# Altium schematic sheet USF-IEEE-CS.SchDoc
size A3; SheetNumber: 1; SheetTotal: 1
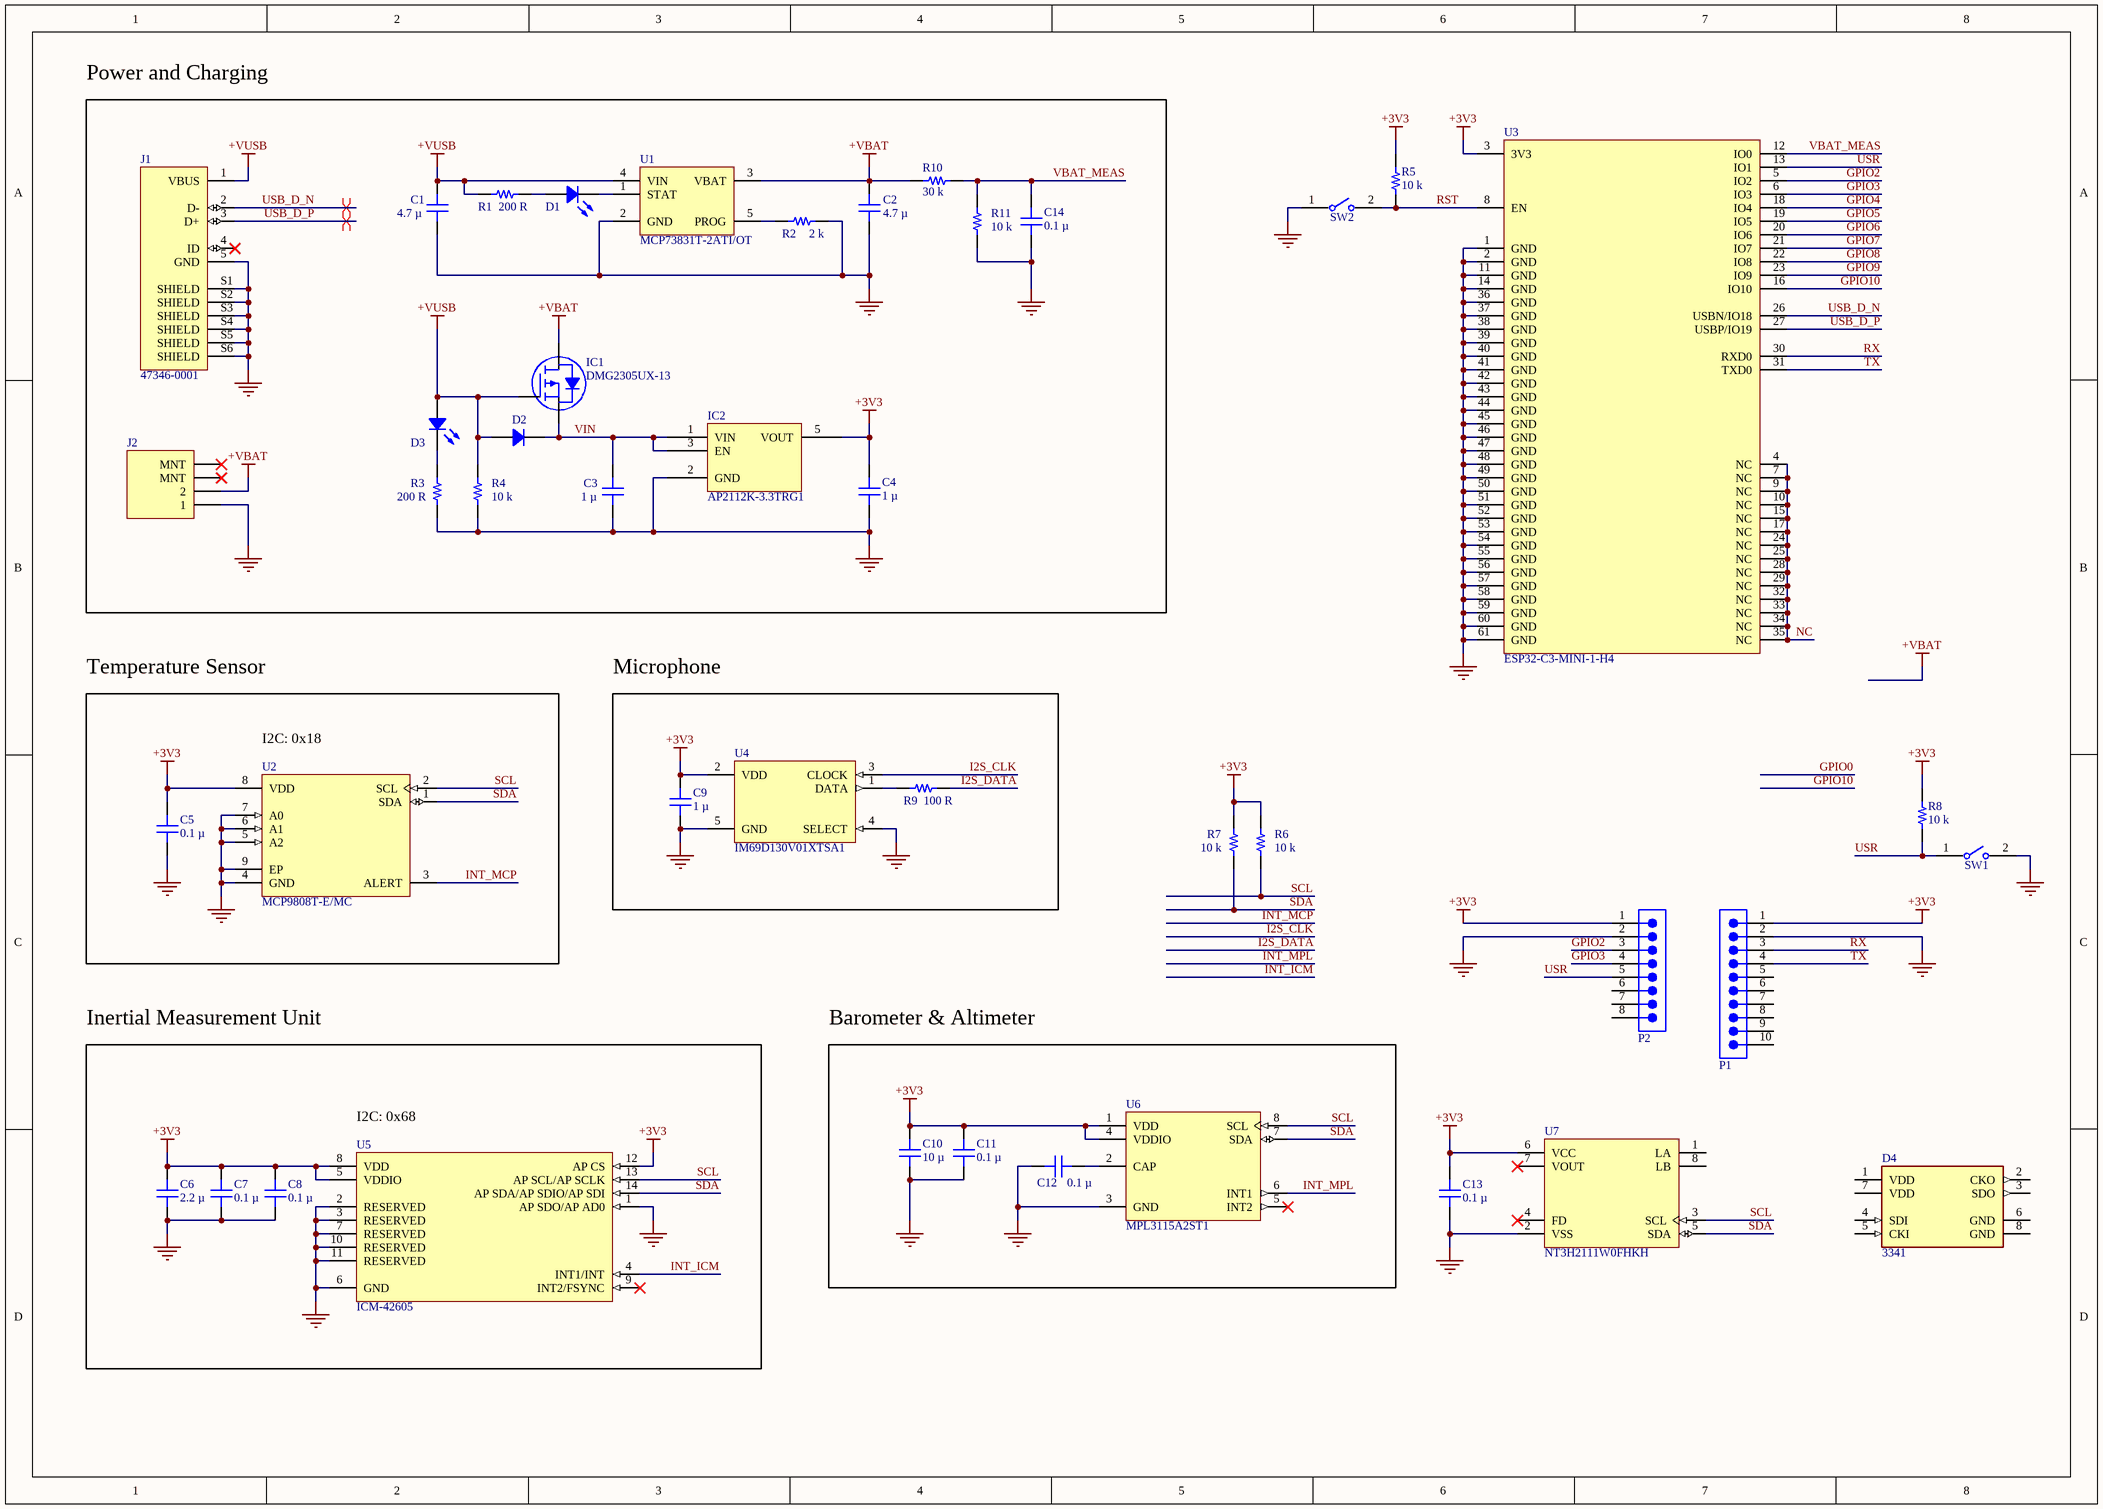
[diagram p0: USF-IEEE-CS.SchDoc]

## Parts
C1  Capacitance: 4.7 µ  [CAP 0402_1005]  (hidden comment: 4.7 µF)
C2  Capacitance: 4.7 µ  [CAP 0402_1005]  (hidden comment: 4.7 µF)
C3  1 µ  [CAP 0402_1005]
C4  1 µ  [CAP 0402_1005]
C5  Capacitance: 0.1 µ  [CAP 0402_1005]  (hidden comment: 0.1 µF)
C6  Capacitance: 2.2 µ  [CAP 0402_1005]  (hidden comment: 2.2 µF)
C7  Capacitance: 0.1 µ  [CAP 0402_1005]  (hidden comment: 0.1 µF)
C8  Capacitance: 0.1 µ  [CAP 0402_1005]  (hidden comment: 0.1 µF)
C9  1 µ  [CAP 0402_1005]
C10  Capacitance: 10 µ  [CAP 0603_1608]  (hidden comment: 10 µF)
C11  Capacitance: 0.1 µ  [CAP 0402_1005]  (hidden comment: 0.1 µF)
C12  Capacitance: 0.1 µ  [CAP 0402_1005]  (hidden comment: 0.1 µF)
C13  Capacitance: 0.1 µ  [CAP 0402_1005]  (hidden comment: 0.1 µF)
C14  Capacitance: 0.1 µ  [CAP 0402_1005]  (hidden comment: 0.1 µF)
D1  Red  [LED 0603_1608 RED]  (value not drawn)
D2  MBR120ESFT1G  [SOD123F]  (value not drawn)
D3  Blue  [LED 0603_1608 BLUE]  (value not drawn)
D4  3341  [FP-3341-MFG]
IC1  DMG2305UX-13  [DIODES SOT-23-3]
IC2  AP2112K-3.3TRG1  [DIODES SOT-23-5 W5]
J1  47346-0001  [MOLEX_47346-0001]
J2  SM02B-GHS-TB(LF)(SN)  [FP-SM02B-GHS-TB_LF_SN-MFG]  (value not drawn)
P1  61301011121  [61301011121]  (value not drawn)
P2  61300811121  [61300811121]  (value not drawn)
R1  200 R  [RES 0402_1005]
R2  2 k  [RES 0402_1005]
R3  200 R  [RES 0402_1005]
R4  10 k  [RES 0402_1005]
R5  10 k  [RES 0402_1005]
R6  10 k  [RES 0402_1005]
R7  10 k  [RES 0402_1005]
R8  10 k  [RES 0402_1005]
R9  100 R  [RES 0402_1005]
R10  30 k  [RES 0402_1005]
R11  10 k  [RES 0402_1005]
SW1  B3U-1000P  [FP-B3U-1000P-MFG]  (value not drawn)
SW2  B3U-1000P  [FP-B3U-1000P-MFG]  (value not drawn)
U1  MCP73831T-2ATI/OT  [FP-C04-091-OT-MFG]
U2  MCP9808T-E/MC  [MCHP-DFN-MC8_V]
U3  ESP32-C3-MINI-1-H4  [ESP32C3MINI1H4]
U4  IM69D130V01XTSA1  [FP-PG-LLGA-5-MFG]
U5  ICM-42605  [FP-ICM-42605-MFG]
U6  MPL3115A2ST1  [FRES-2153-01_V]
U7  NT3H2111W0FHKH  [NT3H2111W0FHKH-FP]

## Blocks framed on the sheet
Power and Charging: C1-C4 C14 D1-D3 IC1 IC2 J1 J2 R1-R4 R10 R11 U1
Temperature Sensor: C5 U2
Microphone: C9 R9 U4
Inertial Measurement Unit: C6-C8 U5
Barometer & Altimeter: C10-C12 U6

## Nets
+3V3: C4.2 C5.2 C6.2 C7.2 C8.2 C9.2 C10.2 C11.2 C13.2 IC2.5(VOUT) P1.1 P2.1 R5.2 R6.2 R7.2 R8.2 U2.8(VDD) U3.3(3V3) U4.2(VDD) U5.5(VDDIO) U5.8(VDD) U5.12(AP_CS) U6.1(VDD) U6.4(VDDIO) U7.6(VCC)
+VBAT: C2.2 IC1.3(D) J2.2 R10.2 U1.3(VBAT)
+VUSB: C1.2 D2.1 D3.1 IC1.1(G) J1.1(VBUS) R1.2 R4.1 U1.4(VIN)
GND: C1.1 C2.1 C3.1 C4.1 C5.1 C6.1 C7.1 C8.1 C9.1 C10.1 C11.1 C12.2 C13.1 C14.1 IC2.2(GND) J1.5(GND) J1.S1(SHIELD) J1.S2(SHIELD) J1.S3(SHIELD) J1.S4(SHIELD) J1.S5(SHIELD) J1.S6(SHIELD) J2.1 P1.2 P2.2 R2.2 R3.1 R4.2 R11.1 SW1.2 SW2.1 U1.2(GND) U2.4(GND) U2.5(A2) U2.6(A1) U2.7(A0) U2.9(EP) U3.1(GND) U3.2(GND) U3.11(GND) U3.14(GND) U3.36(GND) U3.37(GND) U3.38(GND) U3.39(GND) U3.40(GND) U3.41(GND) U3.42(GND) U3.43(GND) U3.44(GND) U3.45(GND) U3.46(GND) U3.47(GND) U3.48(GND) U3.49(GND) U3.50(GND) U3.51(GND) U3.52(GND) U3.53(GND) U3.54(GND) U3.55(GND) U3.56(GND) U3.57(GND) U3.58(GND) U3.59(GND) U3.60(GND) U3.61(GND) U4.4(SELECT) U4.5(GND) U5.1(AP_SDO/AP_AD0) U5.2(RESERVED) U5.3(RESERVED) U5.6(GND) U5.7(RESERVED) U5.10(RESERVED) U5.11(RESERVED) U6.3(GND) U7.2(VSS)
GPIO2: P2.3 U3.5(IO2)
GPIO3: P2.4 U3.6(IO3)
GPIO4: U3.18(IO4)
GPIO5: U3.19(IO5)
GPIO6: U3.20(IO6)
GPIO7: U3.21(IO7)
GPIO8: U3.22(IO8)
GPIO9: U3.23(IO9)
GPIO10: U3.16(IO10)
I2S_CLK: U4.3(CLOCK)
I2S_DATA: R9.2
INT_ICM: U5.4(INT1/INT)
INT_MCP: U2.3(ALERT)
INT_MPL: U6.6(INT1)
NC: U3.4(NC) U3.7(NC) U3.9(NC) U3.10(NC) U3.15(NC) U3.17(NC) U3.24(NC) U3.25(NC) U3.28(NC) U3.29(NC) U3.32(NC) U3.33(NC) U3.34(NC) U3.35(NC)
RST: R5.1 SW2.2 U3.8(EN)
RX: P1.3 U3.30(RXD0)
SCL: R6.1 U2.2(SCL) U5.13(AP_SCL/AP_SCLK) U6.8(SCL) U7.3(SCL)
SDA: R7.1 U2.1(SDA) U5.14(AP_SDA/AP_SDIO/AP_SDI) U6.7(SDA) U7.5(SDA)
TX: P1.4 U3.31(TXD0)
USB_D_N: J1.2(D-) U3.26(USBN/IO18)
USB_D_P: J1.3(D+) U3.27(USBP/IO19)
USR: P2.5 R8.1 SW1.1 U3.13(IO1)
VBAT_MEAS: C14.2 R10.1 R11.2 U3.12(IO0)
VIN: C3.2 D2.2 IC1.2(S) IC2.1(VIN) IC2.3(EN)
NetC12_1: C12.1 U6.2(CAP)
NetD1_1: D1.1 R1.1
NetD1_2: D1.2 U1.1(STAT)
NetD3_2: D3.2 R3.2
NetR2_1: R2.1 U1.5(PROG)
NetR9_1: R9.1 U4.1(DATA)

Not connected (* = marked no-connect by the designer): D4 1(VDD) 2(CKO) 3(SDO) 4(SDI) 5(CKI) 6(GND) 7(VDD) 8(GND); J1 4(ID)*; J2 3(MNT)* 4(MNT)*; P1 5 6 7 8 9 10; P2 6 7 8; U5 9(INT2/FSYNC)*; U6 5(INT2)*; U7 1(LA) 4(FD)* 7(VOUT)* 8(LB)

## Layout directives
differential pair: USB_D_N, USB_D_P

## Notes on the sheet
- (near U2) I2C: 0x18
- (near U5) I2C: 0x68
- DWG. NO.
- REV.
- SHT.
- THIS DOCUMENT AND THE DATA DISCLOSED HEREIN OR HEREWITH IS THE PROPERTY OF ALTIUM LIMITED AND MAY BE FREELY DISTRIBUTED IN WHOLE. NO RIGHTS ARE RESERVED OR EXPRESS OR IMPLIED WARANTEE GIVEN.
- REVISION
- DESCRIPTION
- DATE
- APPROVED
- ENG:
- APPROVALS
- PROJECT
- DSN:
- CHK:
- REFERENCE DOCUMENTS
- PROJECT REVISION:
- TITLE
- DOCUMENT REVISION:
- DESIGN ITEM:
- BOM:
- FAB DWG:
- PCB DWG:
- ASSY DWG:
- SCALE:
- SIZE
- B
- CAGE CODE
- FILE NAME
- DWG NO.
- SHEET
- OF
- REV

## Library data of the parts
C1 C2 = CL05A475KP5NRNC: CAP CER 4.7UF 10V X5R 0402; manufacturer: Samsung Electro-Mechanics; Tolerance: ±10%; Part Number: CL05A475KP5NRNC; Applications: General Purpose; componentlink1description: Datasheet; componentlink1url: http://www.samsungsem.com/kr/support/product-search/mlcc/CL05A475KP5NRNC.jsp; componentlink2description: DigiKey Link; componentlink2url: https://www.digikey.com/en/products/detail/samsung-electro-mechanics/CL05A475KP5NRNC/3887138; Device Package: 0402 (1005 Metric); lastupdated: 2/9/2024 8:04:37 PM; Lifecycle Status: Active; Minimum Order: 1; Mounting Type: Surface Mount, MLCC; Operating Temperature: -55°C ~ 85°C; Package / Case: 0402 (1005 Metric); packaging: TapeAndReel; partid: 2191; Part Status: Active; price: 0.04; series: CL; Size / Dimension: 0.039" L x 0.020" W (1.00mm x 0.50mm); Supplier 1: DigiKey; Supplier Part Number 1: 1276-1480-1-ND; Temperature Coefficient: X5R; Thickness (Max): 0.026" (0.65mm); value: 4.7 µF; Voltage - Rated: 10V
C3 C4 C9 = 885012105012: CAP CER 1UF 10V X5R 0402; manufacturer: Würth Elektronik; Capacitance: 1 µF; Tolerance: ±20%; Part Number: 885012105012; Value: 1 µ; Applications: General Purpose; componentlink1description: Datasheet; componentlink1url: https://katalog.we-online.de/pbs/datasheet/885012105012.pdf; componentlink2description: DigiKey Link; componentlink2url: https://www.digikey.com/en/products/detail/würth-elektronik/885012105012/5453344; Device Package: 0402 (1005 Metric); lastupdated: 2/9/2024 8:04:38 PM; Lifecycle Status: Active; Minimum Order: 1; Mounting Type: Surface Mount, MLCC; Operating Temperature: -55°C ~ 85°C; Package / Case: 0402 (1005 Metric); packaging: TapeAndReel; partid: 1807; Part Status: Active; price: 0.16; series: WCAP-CSGP; Size / Dimension: 0.039" L x 0.020" W (1.00mm x 0.50mm); Supplier 1: DigiKey; Supplier Part Number 1: 732-7489-1-ND; Temperature Coefficient: X5R; Thickness (Max): 0.022" (0.55mm); Voltage - Rated: 10V
C5 C7 C8 C11-C14 = CGA2B3X5R1H104M050BB: CAP CER 0.1UF 50V X5R 0402; manufacturer: TDK Corporation; Tolerance: ±20%; Part Number: CGA2B3X5R1H104M050BB; Applications: Automotive; componentlink1description: Datasheet; componentlink1url: https://product.tdk.com/info/en/catalog/datasheets/mlcc_automotive_general_en.pdf?ref_disty=digikey; componentlink2description: DigiKey Link; componentlink2url: https://www.digikey.com/en/products/detail/tdk-corporation/CGA2B3X5R1H104M050BB/3949450; Device Package: 0402 (1005 Metric); lastupdated: 2/9/2024 8:04:38 PM; Lifecycle Status: Active; Minimum Order: 1; Mounting Type: Surface Mount, MLCC; Operating Temperature: -55°C ~ 85°C; Package / Case: 0402 (1005 Metric); packaging: TapeAndReel; partid: 1792; Part Status: Active; price: 0.01; Ratings: AEC-Q200; series: CGA; Size / Dimension: 0.039" L x 0.020" W (1.00mm x 0.50mm); Supplier 1: DigiKey; Supplier Part Number 1: 445-12214-1-ND; Temperature Coefficient: X5R; Thickness (Max): 0.022" (0.55mm); value: 0.1 µF; Voltage - Rated: 50V
C6 = TMK105CBJ225KV-F: CAP CER 2.2UF 25V X5R 0402; manufacturer: Taiyo Yuden; Tolerance: ±10%; Part Number: TMK105CBJ225KV-F; Applications: SMPS Filtering; componentlink1description: Datasheet; componentlink1url: https://ds.yuden.co.jp/TYCOMPAS/ut/detail?pn=TMK105CBJ225KV-F &u=M; componentlink2description: DigiKey Link; componentlink2url: https://www.digikey.com/en/products/detail/taiyo-yuden/TMK105CBJ225KV-F/7403799; Device Package: 0402 (1005 Metric); lastupdated: 2/9/2024 8:04:38 PM; Lifecycle Status: Active; Minimum Order: 1; Mounting Type: Surface Mount, MLCC; Operating Temperature: -55°C ~ 85°C; Package / Case: 0402 (1005 Metric); packaging: TapeAndReel; partid: 1822; Part Status: Active; price: 0.02; series: M; Size / Dimension: 0.039" L x 0.020" W (1.00mm x 0.50mm); Supplier 1: DigiKey; Supplier Part Number 1: 587-6277-1-ND; Temperature Coefficient: X5R; Thickness (Max): 0.028" (0.70mm); value: 2.2 µF; Voltage - Rated: 25V
C10 = GRT188R61C106ME13D: CAP CER 10UF 16V X5R 0603; manufacturer: Murata Electronics; Tolerance: ±20%; Part Number: GRT188R61C106ME13D; Applications: Automotive; componentlink1description: Datasheet; componentlink1url: https://search.murata.co.jp/Ceramy/image/img/A01X/G101/ENG/GRT188R61C106ME13-01.pdf; componentlink2description: DigiKey Link; componentlink2url: https://www.digikey.com/en/products/detail/murata-electronics/GRT188R61C106ME13D/5416740; Device Package: 0603 (1608 Metric); lastupdated: 2/9/2024 8:10:30 PM; Lifecycle Status: Active; Minimum Order: 1; Mounting Type: Surface Mount, MLCC; Operating Temperature: -55°C ~ 85°C; Package / Case: 0603 (1608 Metric); packaging: TapeAndReel; partid: 2515; Part Status: Active; price: 0.06; Ratings: AEC-Q200; series: GRT; Size / Dimension: 0.063" L x 0.031" W (1.60mm x 0.80mm); Supplier 1: DigiKey; Supplier Part Number 1: 490-12318-1-ND; Temperature Coefficient: X5R; Thickness (Max): 0.035" (0.90mm); value: 10 µF; Voltage - Rated: 16V
D1 = XZMDK53W-8ST: LED RED CLEAR CHIP SMD; Manufacturer: SunLED; Configuration: Standard; Current - Test: 20mA; Lens Color: Colorless; Lens Size: 0.70mm Dia; Lens Style: Round with Domed Top; Millicandela Rating: 507mcd; Viewing Angle: 100°; Voltage - Forward (Vf) (Typ): 1.95V; Wavelength - Dominant: 630nm; Wavelength - Peak: 645nm; Part Number: XZMDK53W-8ST; Color: Red; ComponentLink1Description: Datasheet; ComponentLink1URL: https://www.sunledusa.com/products/spec/XZMDK53W-8ST.pdf; ComponentLink2Description: DigiKey Link; ComponentLink2URL: https://www.digikey.com/en/products/detail/sunled/XZMDK53W-8ST/8259034; Device Package: 0603 (1608 Metric); Height (Max): 0.80mm; LastUpdated: 6/3/2024 7:59:48 PM; Lens Transparency: Clear; Lifecycle Status: Active; Minimum Order: 1; Mounting Type: Surface Mount; Package / Case: 0603 (1608 Metric); Packaging: TapeAndReel; PartId: 377; Part Status: Active; Price: 0.07; Series: -; Size / Dimension: 1.60mm L x 0.80mm W; Supplier 1: DigiKey; Supplier Part Number 1: 1497-1427-1-ND; Supplier Device Package: Chip LED; Value: Red
D2 = MBR120ESFT1G: DIODE SCHOTTKY 20V 1A SOD123L; Manufacturer: ON Semiconductor; Current - Reverse Leakage @ Vr: 10µA @ 20V; Speed: Fast Recovery =< 500ns, > 200mA (Io); Voltage - Forward (Vf) (Max) @ If: 530mV @ 1A; Part Number: MBR120ESFT1G; ComponentLink1Description: Datasheet; ComponentLink1URL: http://www.onsemi.com/pub/Collateral/MBR120ESFT1-D.PDF; ComponentLink2Description: DigiKey Link; ComponentLink2URL: http://digikey.com/product-detail/en/on-semiconductor/MBR120ESFT1G/MBR120ESFT1GOSCT-ND/964525; Current - Average Rectified (Io): 1A; Diode Type: Schottky; LastUpdated: 6/3/2024 7:54:58 PM; Lifecycle Status: Active; Minimum Order: 1; Mounting Type: Surface Mount; Operating Temperature - Junction: -65°C ~ 150°C; Package / Case: SOD-123F; Packaging: TapeAndReel; PartId: 2351; Part Status: Active; Price: 0.09; Series: -; Supplier 1: DigiKey; Supplier Part Number 1: MBR120ESFT1GOSCT-ND; Supplier Device Package: SOD-123L; Voltage - DC Reverse (Vr) (Max): 20V
D3 = LTST-C193TBKT-5A: LED BLUE CLEAR CHIP SMD; Manufacturer: Lite-On Inc.; Configuration: Standard; Current - Test: 5mA; Lens Color: Colorless; Lens Size: 1.15mm x 0.80mm; Lens Style: Rectangle with Flat Top; Millicandela Rating: 15mcd; Viewing Angle: 130°; Voltage - Forward (Vf) (Typ): 2.8V; Wavelength - Dominant: 470nm; Wavelength - Peak: 468nm; Part Number: LTST-C193TBKT-5A; Color: Blue; ComponentLink1Description: Datasheet; ComponentLink1URL: //media.digikey.com/pdf/Data%20Sheets/Lite-On%20PDFs/LTST-C193TBKT-5A.pdf; ComponentLink2Description: DigiKey Link; ComponentLink2URL: http://digikey.com/product-detail/en/lite-on-inc/LTST-C193TBKT-5A/160-1827-1-ND/2355044; Device Package: 0603 (1608 Metric); Height (Max): 0.45mm; LastUpdated: 6/3/2024 7:57:52 PM; Lens Transparency: Clear; Lifecycle Status: Active; Minimum Order: 1; Mounting Type: Surface Mount; Package / Case: 0603 (1608 Metric); Packaging: TapeAndReel; PartId: 829; Part Status: Active; Price: 0.06; Series: -; Size / Dimension: 1.60mm L x 0.80mm W; Supplier 1: DigiKey; Supplier Part Number 1: 160-1827-1-ND; Supplier Device Package: Chip LED; Value: Blue
D4 = CMP-007-00045-1: DotStar Micro LEDs (APA102-2020) - Smart SMD RGB LED - 10 Pack
IC1 = DMG2305UX-13: MOSFET P-CH 20V 4.2A SOT23; Manufacturer: Diodes Incorporated; Current - Continuous Drain (Id) @ 25°C: 4.2A (Ta); Drive Voltage (Max Rds On,  Min Rds On): 1.8V, 4.5V; FET Type: P-Channel; Gate Charge (Qg) (Max) @ Vgs: 10.2 nC @ 4.5 V; Input Capacitance (Ciss) (Max) @ Vds: 808 pF @ 15 V; Power Dissipation (Max): 1.4W (Ta); Rds On (Max) @ Id, Vgs: 52mOhm @ 4.2A, 4.5V; Vgs (Max): ±8V; Vgs(th) (Max) @ Id: 900mV @ 250µA; Part Number: DMG2305UX-13; ComponentLink1Description: Datasheet; ComponentLink1URL: https://www.diodes.com/assets/Datasheets/DMG2305UX.pdf; ComponentLink2Description: DigiKey Link; ComponentLink2URL: https://www.digikey.com/en/products/detail/diodes-incorporated/DMG2305UX-13/4251560; Drain to Source Voltage (Vdss): 20 V; LastUpdated: 6/3/2024 8:15:20 PM; Lifecycle Status: Active; Minimum Order: 1; Mounting Type: Surface Mount; Operating Temperature: -55°C ~ 150°C (TJ); Package / Case: TO-236-3, SC-59, SOT-23-3; Packaging: TapeAndReel; Part Status: Active; Price: 0.04; Series: -; Supplier 1: DigiKey; Supplier Part Number 1: DMG2305UX-13DICT-ND; Supplier Device Package: SOT-23-3; Technology: MOSFET (Metal Oxide)
IC2 = AP2112K-3.3TRG1: IC REG LINEAR 3.3V 600MA SOT25; Manufacturer: Diodes Incorporated; Control Features: Enable; Current - Quiescent (Iq): 80 µA; Number of Regulators: 1; Output Configuration: Positive; Output Type: Fixed; Protection Features: Over Current, Over Temperature; PSRR: 65sB (100Hz ~ 1KHz); Voltage Dropout (Max): 0.4V @ 600mA; Voltage - Input (Max): 6V; Part Number: AP2112K-3.3TRG1; ComponentLink1Description: Datasheet; ComponentLink1URL: https://www.diodes.com/assets/Datasheets/AP2112.pdf; ComponentLink2Description: DigiKey Link; ComponentLink2URL: https://www.digikey.com/en/products/detail/diodes-incorporated/AP2112K-3-3TRG1/4470746; Current - Output: 600mA; LastUpdated: 6/3/2024 8:17:11 PM; Lifecycle Status: Active; Minimum Order: 1; Mounting Type: Surface Mount; Operating Temperature: -40°C ~ 85°C; Package / Case: SC-74A, SOT-753; Packaging: TapeAndReel; Part Status: Active; Price: 0.08; Series: -; Supplier 1: DigiKey; Supplier Part Number 1: AP2112K-3.3TRG1DICT-ND; Supplier Device Package: SOT-25; Voltage - Output (Min/Fixed): 3.3V
J1 = CMP-002-00079-4: USB - micro B USB 2.0 Receptacle Connector 5 Position Surface Mount, Right Angle; MF: Molex; Purchase-URL: https://pricing.snapeda.com/search/part/47346-0001/?ref=eda; Price: None; Value: *; Availability: In Stock; Case/Package: None; Source: 47346-0001.SchLib; Component Type: Standard; Check_prices: https://www.snapeda.com/parts/47346-0001/Molex/view-part/?ref=eda; SnapEDA_Link: https://www.snapeda.com/parts/47346-0001/Molex/view-part/?ref=snap; MP: 47346-0001; Pins: 11; Design Item ID: 47346-0001
J2 = CMP-002-00092-6: MCU 32-bit LPC1800 ARM Cortex M3 RISC 768KB Flash 3.3V 100-Pin TFBGA Tray
P1 = CMP-002-00280-1: WR-PHD Pin Header, THT, Vertical, pitch 2.54mm, 1 Row, 10P; Manufacturer: Wurth Elektronik; Working Voltage: 250V; Rated Current: 3A; Contact Resistance: 20mOhm; Withstanding Voltage: 500V; Design Item ID: 61301011121; Component Type: Standard; Pin Count: 10; Number of Rows: 1; Mount: Through Hole; Operating Temperature Max: 105°C; Match Code: WR-PHD; ComponentLink1URL: https://www.we-online.com/redexpert/article/61301011121?ad; Packaging: Bag; Operating Temperature Min: -40°C; Manufacturer Part Number: 61301011121; Category: Board-to-Board Connectors; Pins: 10; ComponentLink2URL: https://www.we-online.com/redexpert/spec/61301011121?ad; Pitch: 2.54mm; ComponentLink1Description: Website Link; Orientation: Vertical; Source: WR-PHD.SchLib; Gender: Pin Header; ComponentLink2Description: Datasheet Link
P2 = CMP-002-00265-1: WR-PHD Pin Header, THT, Vertical, pitch 2.54mm, 1 Row, 8P; Manufacturer: Wurth Elektronik; Withstanding Voltage: 500V; Working Voltage: 250V; Rated Current: 3A; Contact Resistance: 20mOhm; Design Item ID: 61300811121; Manufacturer Part Number: 61300811121; Pin Count: 8; Component Type: Standard; ComponentLink1URL: https://www.we-online.com/redexpert/article/61300811121?ad; Gender: Pin Header; ComponentLink1Description: Website Link; Operating Temperature Max: 105°C; Match Code: WR-PHD; Source: WR-PHD.SchLib; ComponentLink2URL: https://www.we-online.com/redexpert/spec/61300811121?ad; Number of Rows: 1; Pitch: 2.54mm; Operating Temperature Min: -40°C; Pins: 8; Mount: Through Hole; Orientation: Vertical; Packaging: Bag; Category: Board-to-Board Connectors; ComponentLink2Description: Datasheet Link
R1 R3 = RN73C1E200RBTD: RES SMD 200 OHM 0.1% 1/16W 0402; Manufacturer: TE Connectivity Passive Product; Power (Watts): 0.063W, 1/16W; Resistance: 200 Ohms; Temperature Coefficient: ±10ppm/°C; Part Number: RN73C1E200RBTD; Value: 200 R; ComponentLink1Description: Datasheet; ComponentLink1URL: https://www.te.com/commerce/DocumentDelivery/DDEController?Action=srchrtrv&DocNm=1773270&DocType=DS&DocLang=English; ComponentLink2Description: DigiKey Link; ComponentLink2URL: https://www.digikey.com/en/products/detail/te-connectivity-passive-product/RN73C1E200RBTD/2375214; Composition: Thin Film; Device Package: 0402 (1005 Metric); Height - Seated (Max): 0.014" (0.35mm); LastUpdated: 2/9/2024 8:30:22 PM; Lifecycle Status: Active; Minimum Order: 1; Number of Terminations: 2; Operating Temperature: -55°C ~ 155°C; Package / Case: 0402 (1005 Metric); Packaging: TapeAndReel; PartId: 2956; Part Status: Active; Price: 0.26; Series: RN73, Holsworthy; Size / Dimension: 0.039" L x 0.020" W (1.00mm x 0.50mm); Supplier 1: DigiKey; Supplier Part Number 1: A121688CT-ND; Supplier Device Package: 0402; Tolerance: ±0.1%
R2 = RR0510P-202-D: RES SMD 2K OHM 0.5% 1/16W 0402; Manufacturer: Susumu; Power (Watts): 0.063W, 1/16W; Resistance: 2 kOhms; Temperature Coefficient: ±25ppm/°C; Part Number: RR0510P-202-D; Value: 2 k; ComponentLink1Description: Datasheet; ComponentLink1URL: http://www.susumu.co.jp/common/pdf/n_catalog_partition05_en.pdf; ComponentLink2Description: DigiKey Link; ComponentLink2URL: https://www.digikey.com/en/products/detail/susumu/RR0510P-202-D/432404; Composition: Thin Film; Device Package: 0402 (1005 Metric); Height - Seated (Max): 0.016" (0.40mm); LastUpdated: 2/9/2024 8:30:21 PM; Lifecycle Status: Active; Minimum Order: 1; Number of Terminations: 2; Operating Temperature: -55°C ~ 125°C; Package / Case: 0402 (1005 Metric); Packaging: TapeAndReel; PartId: 3227; Part Status: Active; Price: 0.01; Series: RR; Size / Dimension: 0.039" L x 0.020" W (1.00mm x 0.50mm); Supplier 1: DigiKey; Supplier Part Number 1: RR05P2.0KDCT-ND; Tolerance: ±0.5%
R4-R8 R11 = RP73PF1E10KBTD: RES 10K OHM 0.1% 1/10W 0402; Manufacturer: TE Connectivity Passive Product; Power (Watts): 0.1W, 1/10W; Resistance: 10 kOhms; Temperature Coefficient: ±25ppm/°C; Part Number: RP73PF1E10KBTD; Value: 10 k; ComponentLink1Description: Datasheet; ComponentLink1URL: https://www.te.com/commerce/DocumentDelivery/DDEController?Action=srchrtrv&DocNm=1773272&DocType=DS&DocLang=English; ComponentLink2Description: DigiKey Link; ComponentLink2URL: https://www.digikey.com/en/products/detail/te-connectivity-passive-product/RP73PF1E10KBTD/8260957; Composition: Thin Film; Device Package: 0402 (1005 Metric); Height - Seated (Max): 0.014" (0.35mm); LastUpdated: 2/9/2024 8:30:24 PM; Lifecycle Status: Active; Minimum Order: 1; Number of Terminations: 2; Operating Temperature: -55°C ~ 155°C; Package / Case: 0402 (1005 Metric); Packaging: TapeAndReel; PartId: 2434; Part Status: Active; Price: 0.08; Series: RP73, Holsworthy; Size / Dimension: 0.039" L x 0.020" W (1.00mm x 0.50mm); Supplier 1: DigiKey; Supplier Part Number 1: A127415CT-ND; Supplier Device Package: 0402; Tolerance: ±0.1%
R9 = CR0402AJW-101GAS: RESA-AS 0402 100R 5% 63MW TC200; Manufacturer: Bourns Inc.; Power (Watts): 0.063W, 1/16W; Resistance: 100 Ohms; Temperature Coefficient: ±200ppm/°C; Part Number: CR0402AJW-101GAS; Value: 100 R; ComponentLink1Description: Datasheet; ComponentLink1URL: //media.digikey.com/pdf/Data%20Sheets/Bourns%20PDFs/CRyyyyA-AS_Model_DS.pdf; ComponentLink2Description: DigiKey Link; ComponentLink2URL: https://www.digikey.com/en/products/detail/bourns-inc/CR0402AJW-101GAS/10240111; Composition: Thick Film; Device Package: 0402 (1005 Metric); Features: Anti-Sulfur, Automotive AEC-Q200, Moisture Resistant; Height - Seated (Max): 0.015" (0.37mm); LastUpdated: 2/9/2024 8:30:14 PM; Lifecycle Status: Active; Minimum Order: 1; Number of Terminations: 2; Operating Temperature: -55°C ~ 155°C; Package / Case: 0402 (1005 Metric); Packaging: CutTape; PartId: 4699; Part Status: Active; Price: 0.01; Ratings: AEC-Q200; Series: CR0402A-AS; Size / Dimension: 0.039" L x 0.020" W (1.00mm x 0.50mm); Supplier 1: DigiKey; Supplier Part Number 1: CR0402AJW-101GASCT-ND; Supplier Device Package: 0402; Tolerance: ±5%
R10 = CPF0402B30KE1: RES SMD 30K OHM 0.1% 1/16W 0402; Manufacturer: TE Connectivity Passive Product; Power (Watts): 0.063W, 1/16W; Resistance: 30 kOhms; Temperature Coefficient: ±25ppm/°C; Part Number: CPF0402B30KE1; Value: 30 k; ComponentLink1Description: Datasheet; ComponentLink1URL: https://www.te.com/commerce/DocumentDelivery/DDEController?Action=srchrtrv&DocNm=1773200&DocType=DS&DocLang=English; ComponentLink2Description: DigiKey Link; ComponentLink2URL: https://www.digikey.com/en/products/detail/te-connectivity-passive-product/CPF0402B30KE1/2381839; Composition: Thin Film; Device Package: 0402 (1005 Metric); Height - Seated (Max): 0.014" (0.35mm); LastUpdated: 2/9/2024 8:30:20 PM; Lifecycle Status: Active; Minimum Order: 1; Number of Terminations: 2; Operating Temperature: -55°C ~ 155°C; Package / Case: 0402 (1005 Metric); Packaging: TapeAndReel; PartId: 3356; Part Status: Active; Price: 0.13; Series: CPF, Neohm; Size / Dimension: 0.039" L x 0.020" W (1.00mm x 0.50mm); Supplier 1: DigiKey; Supplier Part Number 1: A102785CT-ND; Supplier Device Package: 0402; Tolerance: ±0.1%
SW1 SW2 = CMP-011-00015-1: Keypad Switch, 1 Switches, SPST, Momentary-tactile, 0.05A, 12VDC, 1.99N, Solder Terminal, Surface Mount-straight; RoHS Compliant: Yes; Max Operating Temperature: 70°C; Mounting Technology: Surface Mount; Min Operating Temperature: -25°C
U1 = CMP-00029-00010-2: Power Supply Support Circuit, Adjustable, 1 Channel, 3.45, PDSO5; Battery Chemistry: Lithium Ion/Polymer; Charge Current Max: 500mA; Voltage Supply Max: 6V; Battery Voltage: 4.2V; Max Operating Temperature: 85°C; RoHS Compliant: Yes; Mounting Technology: Surface Mount; Pins: 5; Min Operating Temperature: -40°C; Case/Package: SOT-23-5
U2 = CMP-010-00025-8: Serial Switch/Digital Sensor, 16 Bit(s), 1Cel, Rectangular, 8 Pin, Surface Mount; Min Supply Voltage: 2.7V; Max Supply Voltage: 5.5V; Sensor Type: TEMPERATURE SENSOR,SWITCH/DIGITAL OUTPUT,SERIAL; Mounting Technology: Surface Mount; Max Operating Temperature: 125°C; RoHS Compliant: Yes; Min Operating Temperature: -40°C; Pins: 8
U3 = CMP-031-00010-2: Bluetooth, WiFi 802.11b/g/n, Bluetooth v5.0 Transceiver Module 2.412GHz ~ 2.484GHz PCB Trace Surface Mount; Manufacturer Part Number: ESP32-C3-MINI-1-H4; Design Item ID: ESP32-C3-MINI-1-H4; Case/Package: 53-SMD Module
U4 = CMP-010-00029-1: Consumer Circuit, PBGA5; Min Supply Voltage: 1.62V; Max Supply Voltage: 3.6V; Max Operating Temperature: 70°C; Min Operating Temperature: -40°C; RoHS Compliant: Yes; Pins: 5; Case/Package: LGA
U5 = CMP-010-00031-4: Open-drain, CMOS, 14 Pin
U6 = CMP-010-00030-2: Piezoresistive Sensor, Absolute, 2.9Psi Min, 15.9Psi Max, 0.1-0.9V, Rectangular, Surface Mount
U7 = CMP-00025-00003-3: RFID Transponder IC 13.56MHz ISO 14443 I2C 3.3V 8-XFQFN Exposed Pad; Mounting Technology: Surface Mount; RoHS Compliant: Yes; Case/Package: 8-XFQFN; Frequency: 13.56MHz; Pins: 8; Voltage Rating: 3.3V; Min Operating Temperature: -40°C; Max Operating Temperature: 105°C